# EAGLE schematic usb ir tester (EAGLE 6.1)
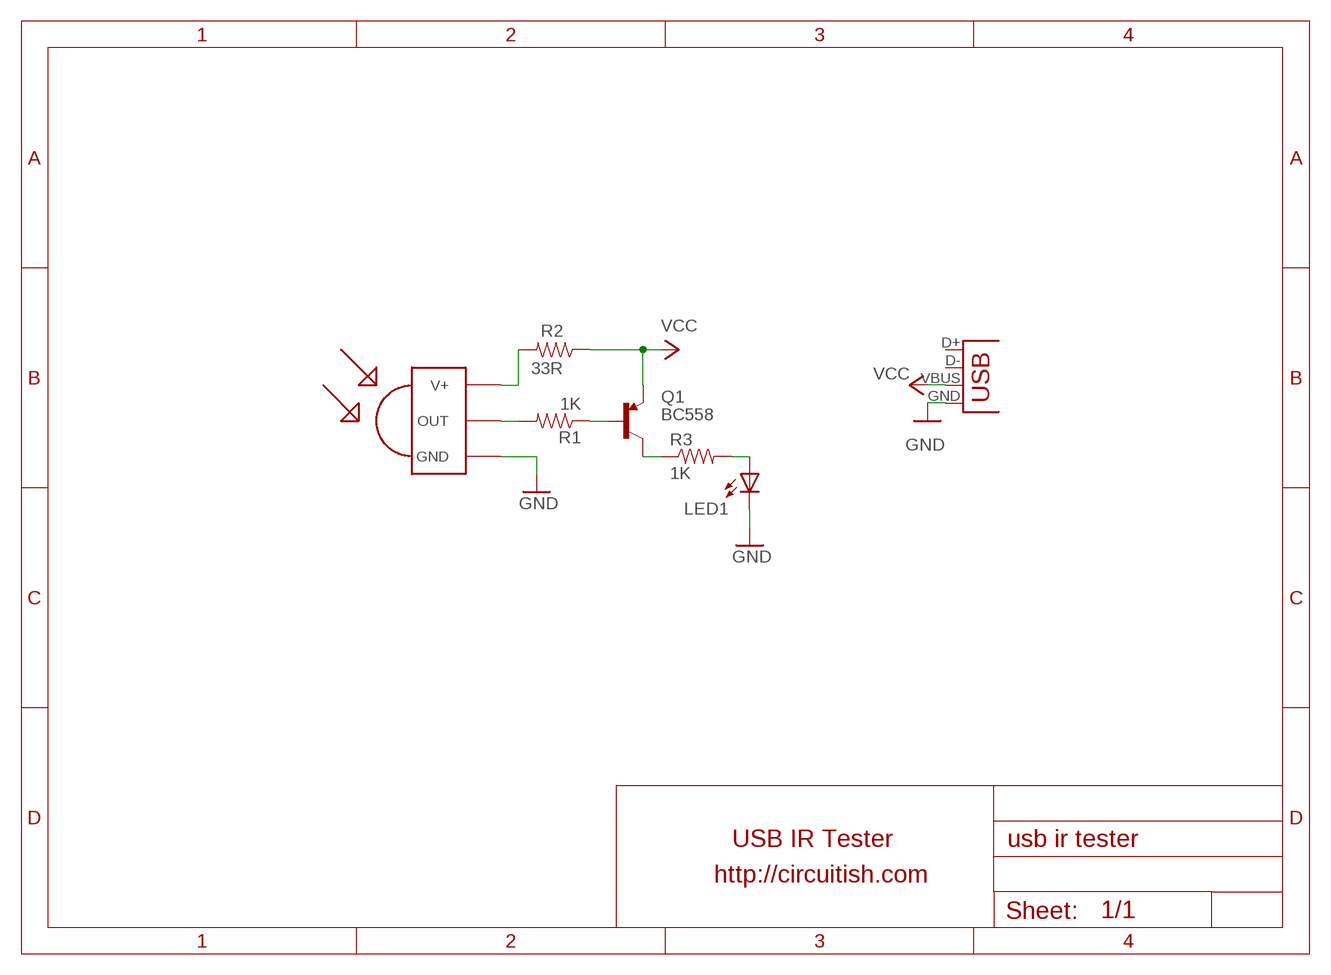
[diagram p0: schematic, sheet 1]

## Parts
LED1  LED0603  [LED-0603]
Q1  BC558  TRANSISTOR_PNPSMD  [SOT23-3]
R1  1K  RESISTOR0805-RES  [0805]
R2  33R  RESISTOR0805-RES  [0805]
R3  1K  RESISTOR0805-RES  [0805]
U$1  TSOP1738  [TSOP17XX]
USB  USB Mini  USB-SMD-NS  [USB-MINIB-NOSTOP]

## Nets
GND: LED1.C U$1.GND USB.GND
N$1: R1.2 U$1.OUT
N$2: Q1.3(C) R3.1
N$3: Q1.1(B) R1.1
N$4: LED1.A R3.2
N$5: R2.2 U$1.V+
VCC: Q1.2(E) R2.1 USB.VBUS
Unconnected: USB.D+ USB.D-

## Notes on the sheet
- USB IR Tester
- http://circuitish.com

## Library data of the parts
LED1 = SparkFun-LED:LED: LEDs Standard schematic elements and footprints for 5mm, 3mm, 1206, and 0603 sized LEDs. 5mm - Spark Fun Electronics SKU : COM-00529 (and others)
Q1 = SparkFun-DiscreteSemi:TRANSISTOR_PNP: Generic PNP BJT. Double check pinouts against datasheets- not all devices are the same!
R1-R3 = SparkFun-Passives:RESISTOR: Resistor Basic schematic elements and footprints for 0603, 1206, and PTH resistors.
U$1 = tsop:TSOP1738: IR Receiver and Demodulator
USB = SparkFun-Connectors:USB: USB Connectors USB-B-PTH is fully proven SKU : PRT-00139 USB-miniB is fully proven SKU : PRT-00587 USB-A-PCB is untested. USB-A-H is throughly reviewed, but untested. Spark Fun Electronics SKU : PRT-00437 USB-B-SMT is throughly reviewed, but untested. Needs silkscreen touching up. USB-A-S has not been used/tested USB-MB-H has not been used/tested